# EAGLE schematic Evaluation_Board_v1.0 (EAGLE 9.6.2)
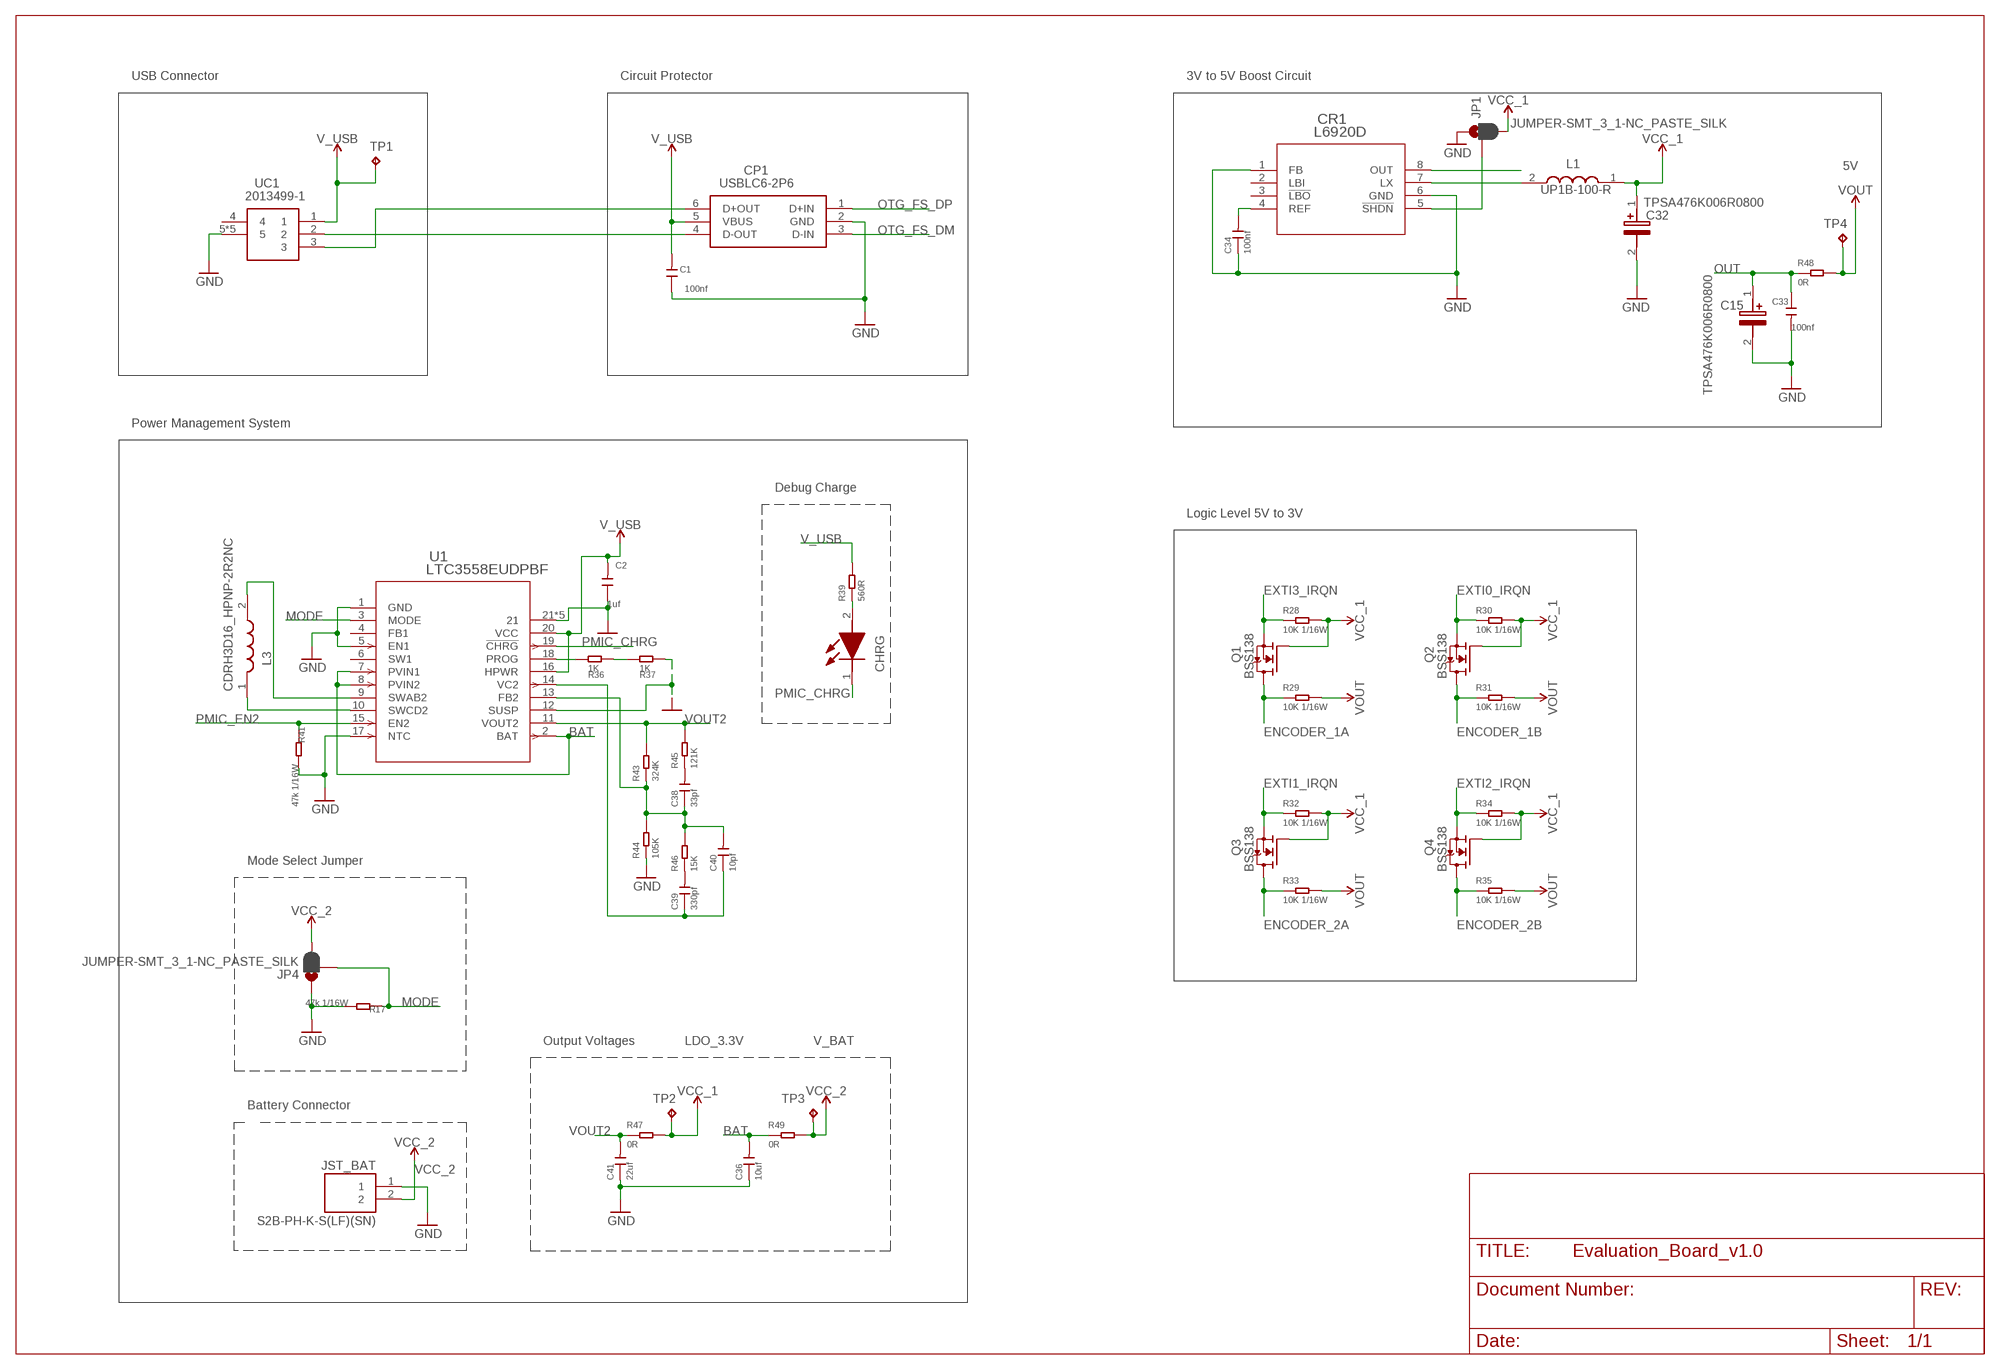
[diagram p0: schematic, sheet 1, part 1 of 3]
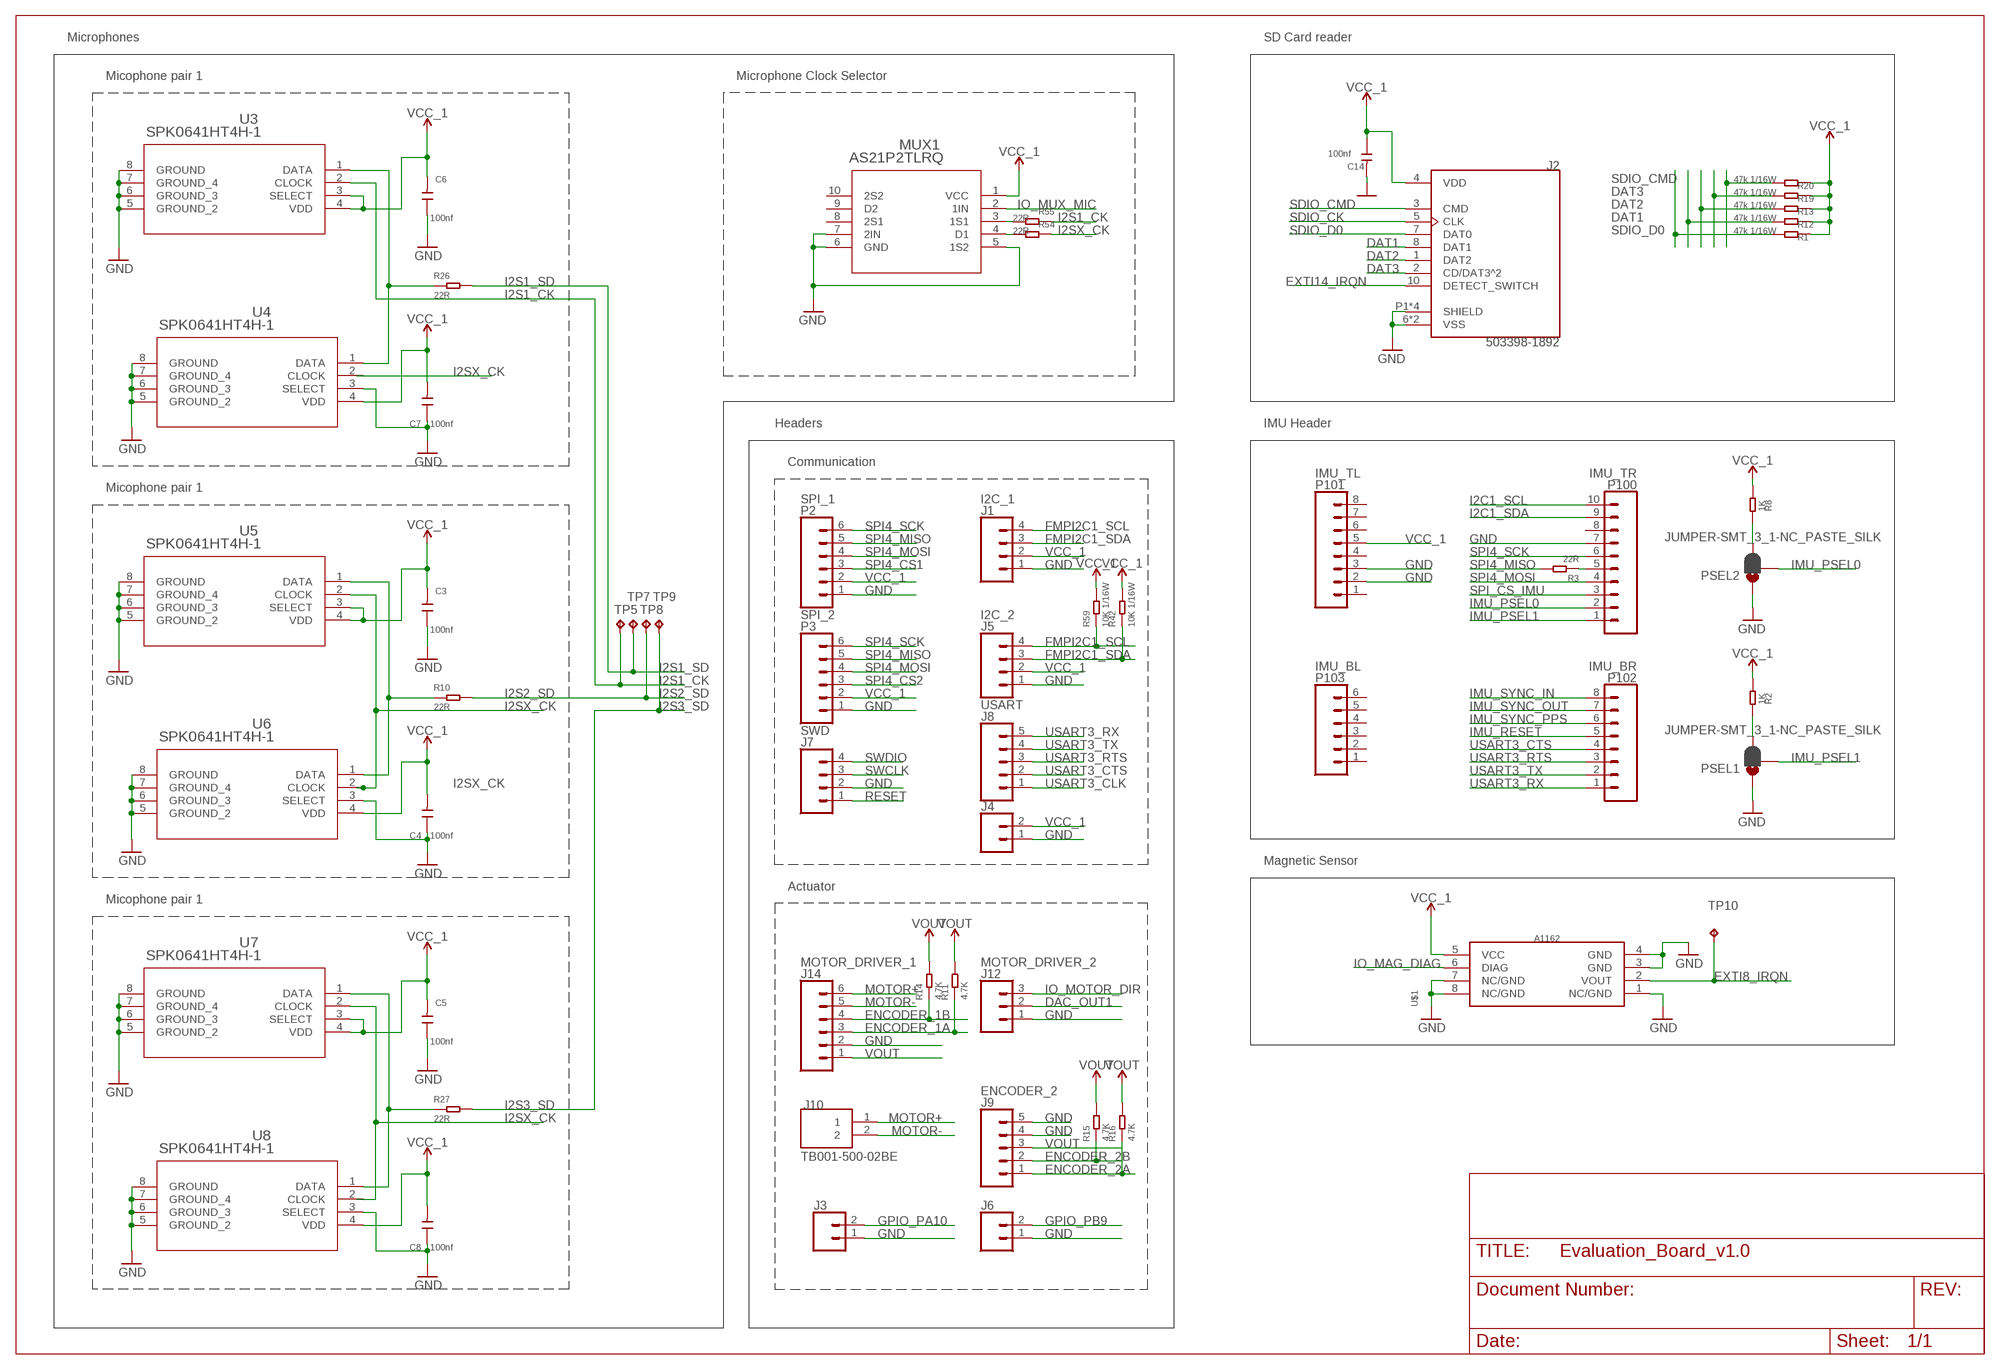
[diagram p1: schematic, sheet 1, part 2 of 3]
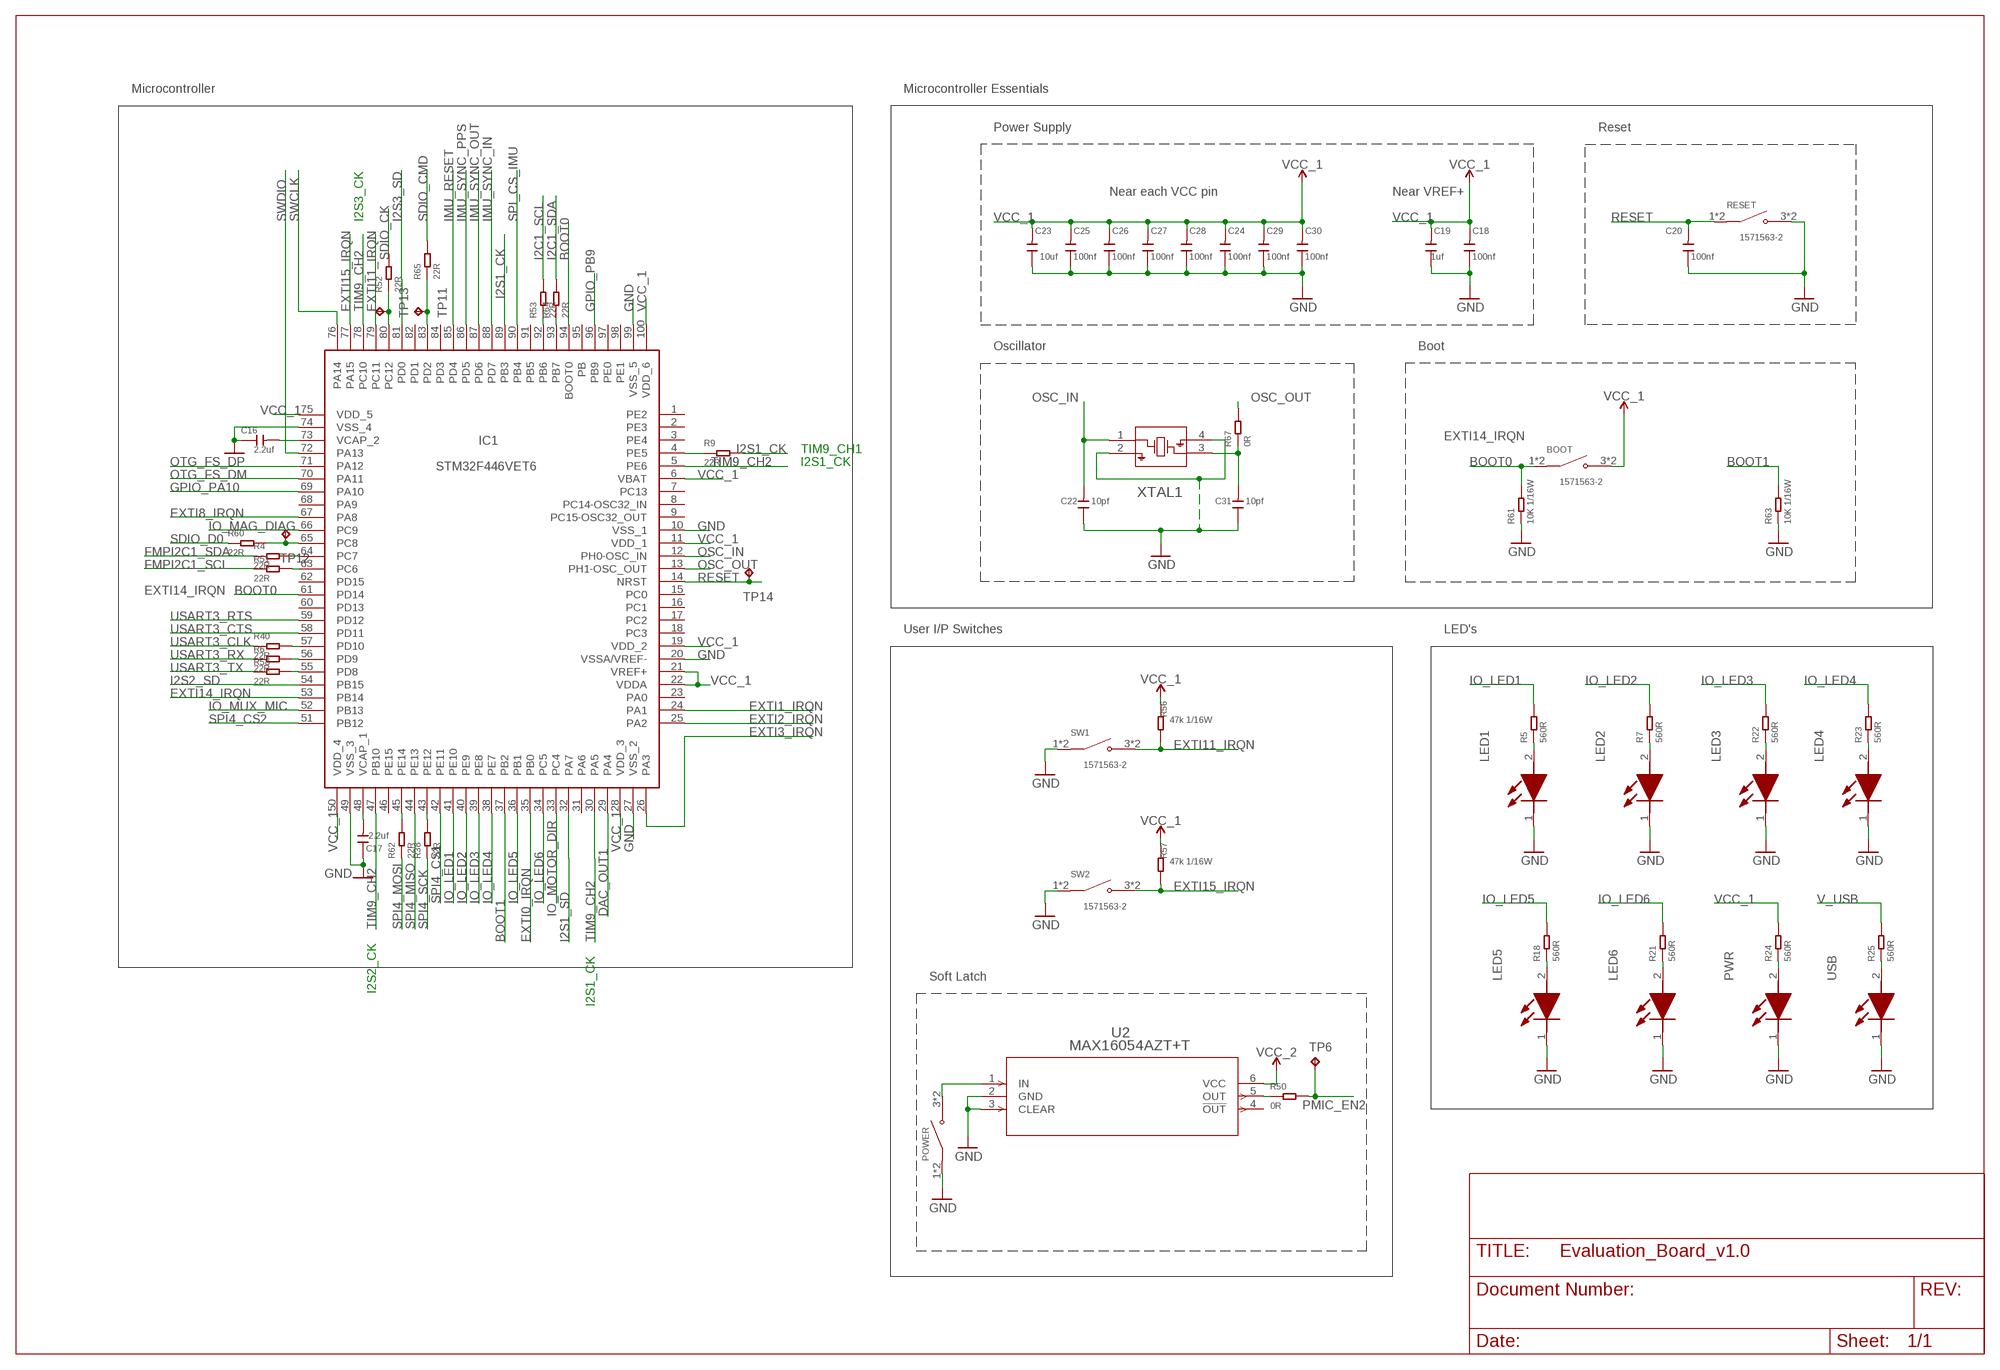
[diagram p2: schematic, sheet 1, part 3 of 3]

## Parts
BOOT  1571563-2  [SW_1571563-2]
C1  100nf  CERAMIC-100NF-25V-10%-X7R(0402)  [C0402]
C2  1uf  CERAMIC-1UF-10V-10%-X5R(0402)  [C0402]
C3  100nf  CERAMIC-100NF-25V-10%-X7R(0402)  [C0402]
C4  100nf  CERAMIC-100NF-25V-10%-X7R(0402)  [C0402]
C5  100nf  CERAMIC-100NF-25V-10%-X7R(0402)  [C0402]
C6  100nf  CERAMIC-100NF-25V-10%-X7R(0402)  [C0402]
C7  100nf  CERAMIC-100NF-25V-10%-X7R(0402)  [C0402]
C8  100nf  CERAMIC-100NF-25V-10%-X7R(0402)  [C0402]
C14  100nf  CERAMIC-100NF-25V-10%-X7R(0402)  [C0402]
C15  TPSA476K006R0800  [CAPPM3216X180N]
C16  2.2uf  CERAMIC-2.2UF-10V-10%-X7R(0603)  [C0603]
C17  2.2uf  CERAMIC-2.2UF-10V-10%-X7R(0603)  [C0603]
C18  100nf  CERAMIC-100NF-25V-10%-X7R(0402)  [C0402]
C19  1uf  CERAMIC-1UF-10V-10%-X5R(0402)  [C0402]
C20  100nf  CERAMIC-100NF-25V-10%-X7R(0402)  [C0402]
C22  10pf  CERAMIC-10PF-50V-5%-NPO(0402)  [C0402]
C23  10uf  CERAMIC-10UF-10V-10%-X5R(0603)  [C0603]
C24  100nf  CERAMIC-100NF-25V-10%-X7R(0402)  [C0402]
C25  100nf  CERAMIC-100NF-25V-10%-X7R(0402)  [C0402]
C26  100nf  CERAMIC-100NF-25V-10%-X7R(0402)  [C0402]
C27  100nf  CERAMIC-100NF-25V-10%-X7R(0402)  [C0402]
C28  100nf  CERAMIC-100NF-25V-10%-X7R(0402)  [C0402]
C29  100nf  CERAMIC-100NF-25V-10%-X7R(0402)  [C0402]
C30  100nf  CERAMIC-100NF-25V-10%-X7R(0402)  [C0402]
C31  10pf  CERAMIC-10PF-50V-5%-NPO(0402)  [C0402]
C32  TPSA476K006R0800  [CAPPM3216X180N]
C33  100nf  CERAMIC-100NF-25V-10%-X7R(0402)  [C0402]
C34  100nf  CERAMIC-100NF-25V-10%-X7R(0402)  [C0402]
C36  10uf  CERAMIC-10UF-10V-10%-X5R(0603)  [C0603]
C38  33pf  CERAMIC-33PF-50V-5%-NPO(0402)  [C0402]
C39  330pf  CERAMIC-33PF-50V-5%-NPO(0402)  [C0402]
C40  10pf  CERAMIC-10PF-50V-5%-NPO(0402)  [C0402]
C41  22uf  CERAMIC-22UF-6.3V-20%-X5R(0805)  [C0805]
CHRG  SML-P12MTT86R  [LEDM106X25N]
CP1  USBLC6-2P6  [USBLC62P6]
CR1  L6920D  [TSSOP8_STM]
IC1  STM32F446VET6  [QFP50P1600X1600X160-100N]
J1  I2C_1  CONN_04  [1X04]
J2  503398-1892  [MOLEX_503398-1892]
J3  CONN_02  [1X02]
J4  CONN_02  [1X02]
J5  I2C_2  CONN_04  [1X04]
J6  CONN_02  [1X02]
J7  SWD  CONN_04  [1X04]
J8  USART  CONN_05  [1X05]
J9  ENCODER_2  CONN_05  [1X05]
J10  TB001-500-02BE  [CUI_TB001-500-02BE]
J12  MOTOR_DRIVER_2  CONN_03  [1X03]
J14  MOTOR_DRIVER_1  CONN_06POLAR  [MOLEX-1X6]
JP1  JUMPER-SMT_3_1-NC_PASTE_SILK  [SMT-JUMPER_3_1-NC_PASTE_SILK]
JP4  JUMPER-SMT_3_1-NC_PASTE_SILK  [SMT-JUMPER_3_1-NC_PASTE_SILK]
JST_BAT  S2B-PH-K-S(LF)(SN)  [JST_S2B-PH-K-S(LF)(SN)]
L1  UP1B-100-R  [INDM9060X500N]
L3  CDRH3D16_HPNP-2R2NC  [CDRH3D16HPNP2R2NC]
LED1  SML-P12MTT86R  [LEDM106X25N]
LED2  SML-P12MTT86R  [LEDM106X25N]
LED3  SML-P12MTT86R  [LEDM106X25N]
LED4  SML-P12MTT86R  [LEDM106X25N]
LED5  SML-P12MTT86R  [LEDM106X25N]
LED6  SML-P12MTT86R  [LEDM106X25N]
MUX1  AS21P2TLRQ  [QFN10_1P8X1P4X0P5_STM]
P2  SPI_1  CONN_06SILK_FEMALE_PTH  [1X06]
P3  SPI_2  CONN_06SILK_FEMALE_PTH  [1X06]
P100  IMU_TR  CONN_10"  [1X10]
P101  IMU_TL  CONN_08"  [1X08]
P102  IMU_BR  CONN_08"  [1X08]
P103  IMU_BL  CONN_06SILK_FEMALE_PTH  [1X06]
POWER  1571563-2  [SW_1571563-2]
PSEL1  JUMPER-SMT_3_1-NC_PASTE_SILK  [SMT-JUMPER_3_1-NC_PASTE_SILK]
PSEL2  JUMPER-SMT_3_1-NC_PASTE_SILK  [SMT-JUMPER_3_1-NC_PASTE_SILK]
PWR  SML-P12MTT86R  [LEDM106X25N]
Q1  BSS138  [SOT95P240X111-3N]
Q2  BSS138  [SOT95P240X111-3N]
Q3  BSS138  [SOT95P240X111-3N]
Q4  BSS138  [SOT95P240X111-3N]
R1  47k 1/16W  SMD-RES-47R-1%-1/16W(0402)  [R0402]
R2  1K  SMD-RES-1K-1%-1/10W(0603)  [R0603]
R3  22R  SMD-RES-22R-1%-1/16W(0402)  [R0402]
R4  22R  SMD-RES-22R-1%-1/16W(0402)  [R0402]
R5  560R  SMD-RES-560R-5%-1/10W(0603)  [R0603]
R6  22R  SMD-RES-22R-1%-1/16W(0402)  [R0402]
R7  560R  SMD-RES-560R-5%-1/10W(0603)  [R0603]
R8  1K  SMD-RES-1K-1%-1/10W(0603)  [R0603]
R9  22R  SMD-RES-22R-1%-1/16W(0402)  [R0402]
R10  22R  SMD-RES-22R-1%-1/16W(0402)  [R0402]
R11  4.7K  SMD-RES-3.3K-1%-1/16W(0402)  [R0402]
R12  47k 1/16W  SMD-RES-47R-1%-1/16W(0402)  [R0402]
R13  47k 1/16W  SMD-RES-47R-1%-1/16W(0402)  [R0402]
R14  4.7K  SMD-RES-3.3K-1%-1/16W(0402)  [R0402]
R15  4.7K  SMD-RES-3.3K-1%-1/16W(0402)  [R0402]
R16  4.7K  SMD-RES-3.3K-1%-1/16W(0402)  [R0402]
R17  47k 1/16W  SMD-RES-47R-1%-1/16W(0402)  [R0402]
R18  560R  SMD-RES-560R-5%-1/10W(0603)  [R0603]
R19  47k 1/16W  SMD-RES-47R-1%-1/16W(0402)  [R0402]
R20  47k 1/16W  SMD-RES-47R-1%-1/16W(0402)  [R0402]
R21  560R  SMD-RES-560R-5%-1/10W(0603)  [R0603]
R22  560R  SMD-RES-560R-5%-1/10W(0603)  [R0603]
R23  560R  SMD-RES-560R-5%-1/10W(0603)  [R0603]
R24  560R  SMD-RES-560R-5%-1/10W(0603)  [R0603]
R25  560R  SMD-RES-560R-5%-1/10W(0603)  [R0603]
R26  22R  SMD-RES-22R-1%-1/16W(0402)  [R0402]
R27  22R  SMD-RES-22R-1%-1/16W(0402)  [R0402]
R28  10K 1/16W  SMD-RES-10K-1%-1/16W(0402)  [R0402]
R29  10K 1/16W  SMD-RES-10K-1%-1/16W(0402)  [R0402]
R30  10K 1/16W  SMD-RES-10K-1%-1/16W(0402)  [R0402]
R31  10K 1/16W  SMD-RES-10K-1%-1/16W(0402)  [R0402]
R32  10K 1/16W  SMD-RES-10K-1%-1/16W(0402)  [R0402]
R33  10K 1/16W  SMD-RES-10K-1%-1/16W(0402)  [R0402]
R34  10K 1/16W  SMD-RES-10K-1%-1/16W(0402)  [R0402]
R35  10K 1/16W  SMD-RES-10K-1%-1/16W(0402)  [R0402]
R36  1K  SMD-RES-1K-1%-1/10W(0603)  [R0603]
R37  1K  SMD-RES-1K-1%-1/10W(0603)  [R0603]
R38  22R  SMD-RES-22R-1%-1/16W(0402)  [R0402]
R39  560R  SMD-RES-560R-5%-1/10W(0603)  [R0603]
R40  22R  SMD-RES-22R-1%-1/16W(0402)  [R0402]
R41  47k 1/16W  SMD-RES-47R-1%-1/16W(0402)  [R0402]
R42  10K 1/16W  SMD-RES-10K-1%-1/16W(0402)  [R0402]
R43  324K  SMD-RES-470K-1%-1/10W(0603)  [R0603]
R44  105K  SMD-RES-470K-1%-1/10W(0603)  [R0603]
R45  121K  SMD-RES-470K-1%-1/10W(0603)  [R0603]
R46  15K  SMD-RES-470K-1%-1/10W(0603)  [R0603]
R47  0R  SMD-RES-0R-1%-1/8W(0805)  [R0805]
R48  0R  SMD-RES-0R-1%-1/8W(0805)  [R0805]
R49  0R  SMD-RES-0R-1%-1/8W(0805)  [R0805]
R50  0R  SMD-RES-0R-1%-1/8W(0805)  [R0805]
R51  22R  SMD-RES-22R-1%-1/16W(0402)  [R0402]
R52  22R  SMD-RES-22R-1%-1/16W(0402)  [R0402]
R53  22R  SMD-RES-22R-1%-1/16W(0402)  [R0402]
R54  22R  SMD-RES-22R-1%-1/16W(0402)  [R0402]
R55  22R  SMD-RES-22R-1%-1/16W(0402)  [R0402]
R56  47k 1/16W  SMD-RES-47R-1%-1/16W(0402)  [R0402]
R57  47k 1/16W  SMD-RES-47R-1%-1/16W(0402)  [R0402]
R58  22R  SMD-RES-22R-1%-1/16W(0402)  [R0402]
R59  10K 1/16W  SMD-RES-10K-1%-1/16W(0402)  [R0402]
R60  22R  SMD-RES-22R-1%-1/16W(0402)  [R0402]
R61  10K 1/16W  SMD-RES-10K-1%-1/16W(0402)  [R0402]
R62  22R  SMD-RES-22R-1%-1/16W(0402)  [R0402]
R63  10K 1/16W  SMD-RES-10K-1%-1/16W(0402)  [R0402]
R64  22R  SMD-RES-22R-1%-1/16W(0402)  [R0402]
R65  22R  SMD-RES-22R-1%-1/16W(0402)  [R0402]
R67  0R  SMD-RES-0R-5%-1/16W(0402)  [R0402]
RESET  1571563-2  [SW_1571563-2]
SW1  1571563-2  [SW_1571563-2]
SW2  1571563-2  [SW_1571563-2]
TP1  TPB1,27  [B1,27]
TP2  TPB1,27  [B1,27]
TP3  TPB1,27  [B1,27]
TP4  TPB1,27  [B1,27]
TP5  TPB1,27  [B1,27]
TP6  TPB1,27  [B1,27]
TP7  TPB1,27  [B1,27]
TP8  TPB1,27  [B1,27]
TP9  TPB1,27  [B1,27]
TP10  TPB1,27  [B1,27]
TP11  TPB1,27  [B1,27]
TP12  TPB1,27  [B1,27]
TP13  TPB1,27  [B1,27]
TP14  TPB1,27  [B1,27]
U1  LTC3558EUDPBF  [QFN-20_UD_LIT]
U2  MAX16054AZT+T  [21-0114C_MXM]
U3  SPK0641HT4H-1  [SPK0641HT4H-1_KNO]
U4  SPK0641HT4H-1  [SPK0641HT4H-1_KNO]
U5  SPK0641HT4H-1  [SPK0641HT4H-1_KNO]
U6  SPK0641HT4H-1  [SPK0641HT4H-1_KNO]
U7  SPK0641HT4H-1  [SPK0641HT4H-1_KNO]
U8  SPK0641HT4H-1  [SPK0641HT4H-1_KNO]
U$1  A1162  [A1162-8]
UC1  2013499-1  [2013499-1]
USB  SML-P12MTT86R  [LEDM106X25N]
XTAL1  NX2520SA-16MHZ  NX2520SA-16MHZ-STD-CSW-4  [NX2520SA_NDK]

## Nets
BAT [Power]: C36.2 R49.1 U1.2(BAT) U1.7(PVIN1) U1.8(PVIN2)
BOOT0: BOOT.1(COM) BOOT.2(COM) IC1.61(PD14) IC1.94(BOOT0) R61.2
BOOT1: IC1.37(PB2) R63.2
DAC_OUT1: IC1.29(PA4) J12.2
DAT1: J2.8(DAT1) R12.1
DAT2: J2.1(DAT2) R13.1
DAT3: J2.2(CD/DAT3^2) R19.1
ENCODER_1A: J14.3 Q1.3(D) R11.1 R29.1
ENCODER_1B: J14.4 Q2.3(D) R14.1 R31.1
ENCODER_2A: J9.1 Q3.3(D) R16.1 R33.1
ENCODER_2B: J9.2 Q4.3(D) R15.1 R35.1
EXTI0_IRQN: IC1.35(PB0) Q2.2(S) R30.1
EXTI1_IRQN: IC1.24(PA1) Q3.2(S) R32.1
EXTI2_IRQN: IC1.25(PA2) Q4.2(S) R34.1
EXTI3_IRQN: IC1.26(PA3) Q1.2(S) R28.1
EXTI8_IRQN: IC1.67(PA8) TP10.TP U$1.2(VOUT)
EXTI11_IRQN: IC1.79(PC11) R56.1 SW1.3(NO) SW1.4(NO)
EXTI14_IRQN: IC1.53(PB14) J2.10(DETECT_SWITCH)
EXTI15_IRQN: IC1.77(PA15) R57.1 SW2.3(NO) SW2.4(NO)
FMPI2C1_SCL [Impedance Match]: J1.4 J5.4 R51.1 R59.1
FMPI2C1_SDA [Impedance Match]: J1.3 J5.3 R4.1 R42.1
GND [Power]: C1.1 C2.1 C3.1 C4.1 C5.1 C6.1 C7.1 C8.1 C14.2 C15.2(-) C16.1 C17.1 C18.1 C19.1 C20.1 C22.1 C23.1 C24.1 C25.1 C26.1 C27.1 C28.1 C29.1 C30.1 C31.1 C32.2(-) C33.2 C34.1 C36.1 C41.1 CP1.2(GND) CR1.1(FB) CR1.6(GND) IC1.10(VSS_1) IC1.20(VSSA/VREF-) IC1.27(VSS_2) IC1.49(VSS_3) IC1.74(VSS_4) IC1.99(VSS_5) J1.1 J2.6(VSS) J2.9(VSS) J2.P1(SHIELD) J2.P2(SHIELD) J2.P3(SHIELD) J2.P4(SHIELD) J3.1 J4.1 J5.1 J6.1 J7.2 J9.4 J9.5 J12.1 J14.2 JP1.1 JP4.1 JST_BAT.1 LED1.1(K) LED2.1(K) LED3.1(K) LED4.1(K) LED5.1(K) LED6.1(K) MUX1.5(1S2) MUX1.6(GND) MUX1.7(2IN) P2.1 P3.1 P100.7 P101.2 P101.3 POWER.1(COM) POWER.2(COM) PSEL1.1 PSEL2.1 PWR.1(K) R17.1 R37.2 R41.1 R44.1 R61.1 R63.1 RESET.3(NO) RESET.4(NO) SW1.1(COM) SW1.2(COM) SW2.1(COM) SW2.2(COM) U1.1(GND) U1.5(EN1) U1.12(SUSP) U1.17(NTC) U1.21 U1.P$1 U1.P$2 U1.P$3 U1.P$4 U2.2(GND) U2.3(CLEAR) U3.5(GROUND_2) U3.6(GROUND_3) U3.7(GROUND_4) U3.8(GROUND) U4.3(SELECT) U4.5(GROUND_2) U4.6(GROUND_3) U4.7(GROUND_4) U4.8(GROUND) U5.5(GROUND_2) U5.6(GROUND_3) U5.7(GROUND_4) U5.8(GROUND) U6.3(SELECT) U6.5(GROUND_2) U6.6(GROUND_3) U6.7(GROUND_4) U6.8(GROUND) U7.5(GROUND_2) U7.6(GROUND_3) U7.7(GROUND_4) U7.8(GROUND) U8.3(SELECT) U8.5(GROUND_2) U8.6(GROUND_3) U8.7(GROUND_4) U8.8(GROUND) U$1.1(NC/GND) U$1.3(GND) U$1.4(GND) U$1.7(NC/GND) U$1.8(NC/GND) UC1.5 UC1.6 UC1.7 UC1.8 UC1.9 USB.1(K) XTAL1.2 XTAL1.4
GPIO_PA10: IC1.69(PA10) J3.2
GPIO_PB9: IC1.96(PB9) J6.2
I2C1_SCL [Impedance Match]: P100.10 R53.2
I2C1_SDA [Impedance Match]: P100.9 R64.2
I2S1_CK [Impedance Match]: IC1.4(PE5) IC1.89(PB3) R9.1 R9.2 R55.2 TP5.TP U3.2(CLOCK)
I2S1_SD [Impedance Match]: IC1.32(PA7) R26.2 TP7.TP
I2S2_SD [Impedance Match]: IC1.54(PB15) R10.2 TP8.TP
I2S3_SD [Impedance Match]: IC1.81(PD0) R27.2 TP9.TP
I2SX_CK [Impedance Match]: R54.2 U4.2(CLOCK) U5.2(CLOCK) U6.2(CLOCK) U7.2(CLOCK) U8.2(CLOCK)
IMU_PSEL0: P100.2 PSEL2.2
IMU_PSEL1: P100.1 PSEL1.2
IMU_RESET: IC1.85(PD4) P102.5
IMU_SYNC_IN: IC1.88(PD7) P102.8
IMU_SYNC_OUT: IC1.87(PD6) P102.7
IMU_SYNC_PPS: IC1.86(PD5) P102.6
IO_LED1: IC1.41(PE10) R5.2
IO_LED2: IC1.40(PE9) R7.2
IO_LED3: IC1.39(PE8) R22.2
IO_LED4: IC1.38(PE7) R23.2
IO_LED5: IC1.36(PB1) R18.2
IO_LED6: IC1.34(PC5) R21.2
IO_MAG_DIAG: IC1.66(PC9) U$1.6(DIAG)
IO_MOTOR_DIR: IC1.33(PC4) J12.3
IO_MUX_MIC: IC1.52(PB13) MUX1.2(1IN)
MODE: JP4.2 R17.2 U1.3(MODE)
MOTOR+ [High Power]: J10.1 J14.6
MOTOR- [High Power]: J10.2 J14.5
N$1: C34.2 CR1.4(REF)
N$2 [Power]: CR1.7(LX) L1.2
N$3 [Differential Impedance]: CP1.4(D-OUT) UC1.2
N$4 [Differential Impedance]: CP1.6(D+OUT) UC1.3
N$5: R36.1 U1.18(PROG)
N$6: R36.2 R37.1
N$7: CHRG.2(A) R39.1
N$8: CR1.5(!SHDN) JP1.2
N$9: C38.2 R45.1
N$10: C17.2 IC1.48(VCAP_1)
N$11: R50.1 U2.5(OUT)
N$12: C38.1 C40.2 R43.1 R44.2 R46.2 U1.13(FB2)
N$13: C39.2 R46.1
N$14: C16.2 IC1.73(VCAP_2)
N$15: POWER.3(NO) POWER.4(NO) U2.1(IN)
N$16: PSEL1.3 R2.1
N$17: MUX1.4(D1) R54.1
N$18: L3.1 U1.10(SWCD2)
N$19 [Impedance Match]: C31.2 R67.1 XTAL1.3
N$20: PSEL2.3 R8.1
N$21: C39.1 C40.1 U1.14(VC2)
N$22: L3.2 U1.9(SWAB2)
N$23: LED1.2(A) R5.1
N$24: MUX1.3(1S1) R55.1
N$25: LED2.2(A) R7.1
N$26 [Impedance Match]: IC1.63(PC6) R51.2
N$27: LED5.2(A) R18.1
N$28: IC1.57(PD10) R40.2
N$29: LED6.2(A) R21.1
N$30 [Impedance Match]: IC1.43(PE12) R38.2
N$31: LED3.2(A) R22.1
N$32 [Impedance Match]: R10.1 U5.1(DATA) U6.1(DATA)
N$33: LED4.2(A) R23.1
N$34 [Impedance Match]: IC1.80(PC12) R52.1 TP13.TP
N$35: PWR.2(A) R24.1
N$36: IC1.92(PB6) R53.1
N$37: R25.1 USB.2(A)
N$38 [Impedance Match]: IC1.64(PC7) R4.2
N$39 [Impedance Match]: IC1.56(PD9) R6.2
N$40 [Impedance Match]: IC1.55(PD8) R58.2
N$41 [Impedance Match]: P100.5 R3.1
N$42 [Impedance Match]: IC1.65(PC8) R60.2 TP12.TP
N$43 [Impedance Match]: R27.1 U7.1(DATA) U8.1(DATA)
N$44 [Impedance Match]: IC1.45(PE14) R62.2
N$46 [Impedance Match]: IC1.93(PB7) R64.1
N$47 [Impedance Match]: IC1.83(PD2) R65.1 TP11.TP
N$49 [Impedance Match]: R26.1 U3.1(DATA) U4.1(DATA)
OSC_IN [Impedance Match]: C22.2 IC1.12(PH0-OSC_IN) XTAL1.1
OSC_OUT [Impedance Match]: IC1.13(PH1-OSC_OUT) R67.2
OTG_FS_DM [Differential Impedance]: CP1.3(D-IN) IC1.70(PA11)
OTG_FS_DP [Differential Impedance]: CP1.1(D+IN) IC1.71(PA12)
OUT [Power]: C15.1(+) C33.1 CR1.8(OUT) R48.1
PMIC_CHRG: CHRG.1(K) U1.19(!CHRG)
PMIC_EN2: R41.2 R50.2 TP6.TP U1.15(EN2)
RESET [Impedance Match]: C20.2 IC1.14(NRST) J7.1 RESET.1(COM) RESET.2(COM) TP14.TP
SDIO_CK [Impedance Match]: J2.5(CLK) R52.2
SDIO_CMD [Impedance Match]: J2.3(CMD) R20.1 R65.2
SDIO_D0 [Impedance Match]: J2.7(DAT0) R1.1 R60.1
SPI4_CS1: IC1.42(PE11) P2.3
SPI4_CS2: IC1.51(PB12) P3.3
SPI4_MISO [Impedance Match]: IC1.44(PE13) P2.5 P3.5 R3.2
SPI4_MOSI [Impedance Match]: P2.4 P3.4 P100.4 R62.1
SPI4_SCK [Impedance Match]: P2.6 P3.6 P100.6 R38.1
SPI_CS_IMU: IC1.90(PB4) P100.3
SWCLK [Impedance Match]: IC1.76(PA14) J7.3
SWDIO [Impedance Match]: IC1.72(PA13) J7.4
TIM9_CH2 [Impedance Match]: IC1.5(PE6) IC1.30(PA5) IC1.47(PB10) IC1.78(PC10)
USART3_CLK [Impedance Match]: J8.1 R40.1
USART3_CTS [Impedance Match]: IC1.58(PD11) J8.2 P102.4
USART3_RTS [Impedance Match]: IC1.59(PD12) J8.3 P102.3
USART3_RX [Impedance Match]: J8.5 P102.1 R6.1
USART3_TX [Impedance Match]: J8.4 P102.2 R58.1
V_USB [Power]: C1.2 C2.2 CP1.5(VBUS) R25.2 R39.2 TP1.TP U1.16(HPWR) U1.20(VCC) UC1.1
VCC_1 [Power]: BOOT.3(NO) BOOT.4(NO) C3.2 C4.2 C5.2 C6.2 C7.2 C8.2 C14.1 C18.2 C19.2 C23.2 C24.2 C25.2 C26.2 C27.2 C28.2 C29.2 C30.2 C32.1(+) IC1.6(VBAT) IC1.11(VDD_1) IC1.19(VDD_2) IC1.21(VREF+) IC1.22(VDDA) IC1.28(VDD_3) IC1.50(VDD_4) IC1.75(VDD_5) IC1.100(VDD_6) J1.2 J2.4(VDD) J4.2 J5.2 JP1.3 L1.1 MUX1.1(VCC) P2.2 P3.2 P101.5 Q1.1(G) Q2.1(G) Q3.1(G) Q4.1(G) R1.2 R2.2 R8.2 R12.2 R13.2 R19.2 R20.2 R24.2 R28.2 R30.2 R32.2 R34.2 R42.2 R47.2 R56.2 R57.2 R59.2 TP2.TP U3.3(SELECT) U3.4(VDD) U4.4(VDD) U5.3(SELECT) U5.4(VDD) U6.4(VDD) U7.3(SELECT) U7.4(VDD) U8.4(VDD) U$1.5(VCC)
VCC_2 [Power]: JP4.3 JST_BAT.2 R49.2 TP3.TP U2.6(VCC)
VOUT [Power]: J9.3 J14.1 R11.2 R14.2 R15.2 R16.2 R29.2 R31.2 R33.2 R35.2 R48.2 TP4.TP
VOUT2 [Power]: C41.2 R43.2 R45.2 R47.1 U1.11(VOUT2)
Unconnected: CR1.2(LBI) CR1.3(!LBO) IC1.1(PE2) IC1.2(PE3) IC1.3(PE4) IC1.7(PC13) IC1.8(PC14-OSC32_IN) IC1.9(PC15-OSC32_OUT) IC1.15(PC0) IC1.16(PC1) IC1.17(PC2) IC1.18(PC3) IC1.23(PA0) IC1.31(PA6) IC1.46(PE15) IC1.60(PD13) IC1.62(PD15) IC1.68(PA9) IC1.82(PD1) IC1.84(PD3) IC1.91(PB5) IC1.95(PB) IC1.97(PE0) IC1.98(PE1) MUX1.8(2S1) MUX1.9(D2) MUX1.10(2S2) P100.8 P101.1 P101.4 P101.6 P101.7 P101.8 P103.1 P103.2 P103.3 P103.4 P103.5 P103.6 U1.4(FB1) U1.6(SW1) U2.4(!OUT) UC1.4

## Notes on the sheet
- USB Connector | Circuit Protector | 3V to 5V Boost Circuit
- Microcontroller | Microcontroller Essentials
- Power Supply | Reset
- 5V
- Near each VCC pin | Near VREF+
- I2S3_CK
- Oscillator | Boot
- Power Management System
- EXTI14_IRQN
- TIM9_CH1
- I2S1_CK
- Debug Charge
- Logic Level 5V to 3V
- EXTI14_IRQN
- User I/P Switches | LED's
- Mode Select Jumper
- Soft Latch
- I2S2_CK
- I2S1_CK
- Output Voltages | LDO_3.3V | V_BAT
- Battery Connector
- Microphones | SD Card reader
- Micophone pair 1 | Microphone Clock Selector
- Headers | IMU Header
- Communication
- Micophone pair 1
- Magnetic Sensor
- Actuator
- Micophone pair 1

## Library data of the parts
BOOT POWER RESET SW1 SW2 = 1571563-2:1571563-2; COMMENT: 1571563-2; DESCRIPTION: Alcoswitch â€¢ Tactile Switches â€¢ Actuator Style: Round â€¢ Contact Configuration: SPST â€¢ Contact Rating: 50mA â€¢ Operating Function: Off [On] â€¢ Termination Type: Printed Circuit; DIGI-KEY_PART_NUMBER: 450-2057-1-ND; EU_ROHS_COMPLIANCE: Compliant; MF: TE Connectivity; MP: 1571563-2; PACKAGE: SMD-6 Omron Electronics; PURCHASE-URL: https://pricing.snapeda.com/search/part/1571563-2/?ref=eda
C1 C3-C8 C14 C18 C20 C24-C30 C33 C34 = OPL_Capacitor:CERAMIC-100NF-25V-10%-X7R(0402): 302010024; MPN: CC0402KRX7R8BB104
C2 C19 = OPL_Capacitor:CERAMIC-1UF-10V-10%-X5R(0402): 302010040; MPN: CC0402KRX5R6BB105
C15 C32 = TPSA476K006R0800:TPSA476K006R0800: Tantalum Capacitors - Solid SMD 47UF 6V 10% Source: Datasheet; DESCRIPTION: Tantalum Capacitors - Solid SMD 47UF 6V 10%; HEIGHT: 1.8mm; MANUFACTURER_NAME: AVX; MANUFACTURER_PART_NUMBER: TPSA476K006R0800; MOUSER_PART_NUMBER: 581-TPSA476K006R0800; MOUSER_PRICE-STOCK: https://www.mouser.com/Search/Refine.aspx?Keyword=581-TPSA476K006R0800
C16 C17 = OPL_Capacitor:CERAMIC-2.2UF-10V-10%-X7R(0603): 302010054; MPN: CC0603KRX7R6BB225
C22 C31 C40 = OPL_Capacitor:CERAMIC-10PF-50V-5%-NPO(0402): 302010001; MPN: CC0402JRNPO9BN100
C23 C36 = OPL_Capacitor:CERAMIC-10UF-10V-10%-X5R(0603): 302010103; MPN: CC0603KRX5R6BB106
C38 = OPL_Capacitor:CERAMIC-33PF-50V-5%-NPO(0402): 302010000; MPN: CC0402JRNPO9BN330
C39 = OPL_Capacitor:CERAMIC-33PF-50V-5%-NPO(0402): 302010000; MPN: CC0402JRNPO9BN330; VALUE: 33pf
C41 = OPL_Capacitor:CERAMIC-22UF-6.3V-20%-X5R(0805): 302010171; MPN: CC0805MKX5R5BB226
CHRG LED1-LED6 PWR USB = SML-P12MTT86R:SML-P12MTT86R: ROHM - SML-P12MTT86R - LED, YELLOW GREEN, 25MCD, 572NM, 0402 Source: Datasheet; DESCRIPTION: ROHM - SML-P12MTT86R - LED, YELLOW GREEN, 25MCD, 572NM, 0402; HEIGHT: 0.25mm; MANUFACTURER_NAME: ROHM Semiconductor; MANUFACTURER_PART_NUMBER: SML-P12MTT86R; MOUSER_PART_NUMBER: 755-SML-P12MTT86R; MOUSER_PRICE-STOCK: https://www.mouser.co.uk/ProductDetail/ROHM-Semiconductor/SML-P12MTT86R/?qs=Ei%2Fnxee9QYiD9LDKTr18UQ%3D%3D
CP1 = USBLC6-2P6:USBLC6-2P6: ESD Suppressors / TVS Diodes High Speed Interface Protection Low Cap Source: Datasheet; DESCRIPTION: ESD Suppressors / TVS Diodes High Speed Interface Protection Low Cap; HEIGHT: 0.6mm; MANUFACTURER_NAME: STMicroelectronics; MANUFACTURER_PART_NUMBER: USBLC6-2P6; MOUSER_PART_NUMBER: 511-USBLC6-2P6; MOUSER_PRICE-STOCK: https://www.mouser.co.uk/ProductDetail/STMicroelectronics/USBLC6-2P6?qs=6ARB0lp6jlViGcbUSvj1Mw%3D%3D
CR1 = L6920D:L6920D; BUILT_BY: EMA_UL_Team; MANUFACTURER_PART_NUMBER: L6920D; SOURCELIBRARY: Updates_to_database_2020-11-10; VENDOR: STMicroelectronics
IC1 = STM32F446VET6:STM32F446VET6: STMICROELECTRONICS - STM32F446VET6 - MCU, 32BIT, CORTEX-M4, 180MHZ, LQFP-100 Source: Datasheet; DESCRIPTION: STMICROELECTRONICS - STM32F446VET6 - MCU, 32BIT, CORTEX-M4, 180MHZ, LQFP-100; HEIGHT: 1.6mm; MANUFACTURER_NAME: STMicroelectronics; MANUFACTURER_PART_NUMBER: STM32F446VET6; MOUSER_PART_NUMBER: 511-STM32F446VET6; MOUSER_PRICE-STOCK: https://www.mouser.co.uk/ProductDetail/STMicroelectronics/STM32F446VET6?qs=Ok1pvOkw6%2Fq9jAtbG%252BoMSQ%3D%3D
J1 J5 J7 = SparkFun-Connectors:CONN_04: Multi connection point. Often used as Generic Header-pin footprint for 0.1 inch spaced/style header connections On any of the 0.1 inch spaced packages, you can populate with these: Break Away Headers - Straight (PRT-00116) Break Away Male Headers - Right Angle (PRT-00553) Female Headers (PRT-00115) Break Away Headers - Machine Pin (PRT-00117) Break Away Female Headers - Swiss Machine Pin (PRT-00743) For SCREWTERMINALS and SPRING TERMINALS visit here: Screw Terimnals on SparkFun.com (5mm/3.5mm/2.54mm spacing) This device is also useful as a general connection point to wire up your design to another part of your project. Our various solder wires solder well into these plated through hole pads. Hook-Up Wire - Assortment (Stranded, 22 AWG) (PRT-11375) Hook-Up Wire - Assortment (Solid Core, 22 AWG) (PRT-11367) View the entire wire category on our website here Special notes: Molex polarized connector foot print use with SKU : PRT-08231 with associated crimp pins and housings. 1MM SMD Version SKU: PRT-10208; PROD_ID: CONN-09696
J2 = 503398-1892:503398-1892: 1.10mm Pitch microSD Memory Card Connector, Normal Mount Surface Mount, Push-Push Type, 1.28mm Height; DESCRIPTION: 9 (8 + 1) Position Card Connector Secure Digital - microSD™ Surface Mount, Right Angle Gold; DIGI-KEY_PART_NUMBER: WM11190CT-ND; MF: Molex; MP: 5033981892; PACKAGE: None; PURCHASE-URL: https://pricing.snapeda.com/search/part/5033981892/?ref=eda
J3 J4 J6 = SparkFun-Connectors:CONN_02: Multi connection point. Often used as Generic Header-pin footprint for 0.1 inch spaced/style header connections On any of the 0.1 inch spaced packages, you can populate with these: Break Away Headers - Straight (PRT-00116) Break Away Male Headers - Right Angle (PRT-00553) Female Headers (PRT-00115) Break Away Headers - Machine Pin (PRT-00117) Break Away Female Headers - Swiss Machine Pin (PRT-00743) For SCREWTERMINALS and SPRING TERMINALS visit here: Screw Terimnals on SparkFun.com (5mm/3.5mm/2.54mm spacing) This device is also useful as a general connection point to wire up your design to another part of your project. Our various solder wires solder well into these plated through hole pads. Hook-Up Wire - Assortment (Stranded, 22 AWG) (PRT-11375) Hook-Up Wire - Assortment (Solid Core, 22 AWG) (PRT-11367) View the entire wire category on our website here Special notes: Molex polarized connector foot print use with: PRT-08233 with associated crimp pins and housings. 2.54_SCREWTERM for use with PRT-10571. 3.5mm Screw Terminal footprints for PRT-08084 5mm Screw Terminal footprints for use with PRT-08432
J8 J9 = SparkFun-Connectors:CONN_05: Multi connection point. Often used as Generic Header-pin footprint for 0.1 inch spaced/style header connections On any of the 0.1 inch spaced packages, you can populate with these: Break Away Headers - Straight (PRT-00116) Break Away Male Headers - Right Angle (PRT-00553) Female Headers (PRT-00115) Break Away Headers - Machine Pin (PRT-00117) Break Away Female Headers - Swiss Machine Pin (PRT-00743) For SCREWTERMINALS and SPRING TERMINALS visit here: Screw Terimnals on SparkFun.com (5mm/3.5mm/2.54mm spacing) This device is also useful as a general connection point to wire up your design to another part of your project. Our various solder wires solder well into these plated through hole pads. Hook-Up Wire - Assortment (Stranded, 22 AWG) (PRT-11375) Hook-Up Wire - Assortment (Solid Core, 22 AWG) (PRT-11367) View the entire wire category on our website here Special notes: Molex polarized connector foot print use with SKU : PRT-08231 with associated crimp pins and housings. 1MM SMD Version SKU: PRT-10208
J10 = TB001-500-02BE:TB001-500-02BE; CUI_PURCHASE_URL: https://www.cuidevices.com/product/interconnect/connectors/terminal-blocks/tb001-500-series?utm_source=snapeda.com&utm_medium=referral&utm_campaign=snapedaBOM; DESCRIPTION: 2~24 Poles, Screw Type, Horizontal, 5.0 Pitch, 22~12 (AWG), Terminal Block Connector; DIGI-KEY_PART_NUMBER: 102-6134-ND; MF: CUI Devices; MP: TB001-500-02BE; PACKAGE: None; PURCHASE-URL: https://pricing.snapeda.com/search/part/TB001-500-02BE/?ref=eda
J12 = SparkFun-Connectors:CONN_03: Multi connection point. Often used as Generic Header-pin footprint for 0.1 inch spaced/style header connections On any of the 0.1 inch spaced packages, you can populate with these: Break Away Headers - Straight (PRT-00116) Break Away Male Headers - Right Angle (PRT-00553) Female Headers (PRT-00115) Break Away Headers - Machine Pin (PRT-00117) Break Away Female Headers - Swiss Machine Pin (PRT-00743) Stackable Header - 3 Pin (Female, 0.1") (PRT-13875) For SCREWTERMINALS and SPRING TERMINALS visit here: Screw Terimnals on SparkFun.com (5mm/3.5mm/2.54mm spacing) This device is also useful as a general connection point to wire up your design to another part of your project. Our various solder wires solder well into these plated through hole pads. Hook-Up Wire - Assortment (Stranded, 22 AWG) (PRT-11375) Hook-Up Wire - Assortment (Solid Core, 22 AWG) (PRT-11367) View the entire wire category on our website here Special notes: Molex polarized connector foot print use with SKU : PRT-08232 with associated crimp pins and housings.
J14 = SparkFun-Connectors:CONN_06: Multi connection point. Often used as Generic Header-pin footprint for 0.1 inch spaced/style header connections On any of the 0.1 inch spaced packages, you can populate with these: Break Away Headers - Straight (PRT-00116) Break Away Male Headers - Right Angle (PRT-00553) Female Headers (PRT-00115) Break Away Headers - Machine Pin (PRT-00117) Break Away Female Headers - Swiss Machine Pin (PRT-00743) Arduino Stackable Header - 6 Pin (PRT-09280) For SCREWTERMINALS and SPRING TERMINALS visit here: Screw Terimnals on SparkFun.com (5mm/3.5mm/2.54mm spacing) This device is also useful as a general connection point to wire up your design to another part of your project. Our various solder wires solder well into these plated through hole pads. Hook-Up Wire - Assortment (Stranded, 22 AWG) (PRT-11375) Hook-Up Wire - Assortment (Solid Core, 22 AWG) (PRT-11367) View the entire wire category on our website here
JP1 JP4 PSEL1 PSEL2 = SparkFun-Jumpers:JUMPER-SMT_3_1-NC_PASTE: Normally closed solder jumper (1 of 2 connections) This jumper has an aperture in the stencil to allow solder paste to bridge one of the two connections. One connection is normally closed (NC), while the other is normally open (NO). Wick off the solder to open the connection. Reapply solder to reclose the connection. Apply solder to the other side instead to change the current path.
JST_BAT = S2B-PH-K-S_LF__SN_:S2B-PH-K-S(LF)(SN): PH Series 2 Position 2.0 mm Through Hole Side Entry Shrouded Header; DESCRIPTION: Connector Header Through Hole, Right Angle 2 position; DIGI-KEY_PART_NUMBER: 455-1719-ND; MF: JST Sales America Inc.; MP: S2B-PH-K-S(LF)(SN); PACKAGE: Custom Package JST Sales America Inc.; PURCHASE-URL: https://pricing.snapeda.com/search/part/S2B-PH-K-S(LF)(SN)/?ref=eda
L1 = UP1B-100-R:UP1B-100-R: POWER INDUCTOR 10H +/-20% 1.5A Source: Datasheet; DESCRIPTION: POWER INDUCTOR 10H +/-20% 1.5A; HEIGHT: mm; MANUFACTURER_NAME: COILTRONICS; MANUFACTURER_PART_NUMBER: UP1B-100-R
L3 = CDRH3D16_HPNP-2R2NC:CDRH3D16_HPNP-2R2NC: Fixed Inductors 2.2uH 2.30A 47ohms Source: Datasheet; DESCRIPTION: Fixed Inductors 2.2uH 2.30A 47ohms; HEIGHT: 1.8mm; MANUFACTURER_NAME: Sumida; MANUFACTURER_PART_NUMBER: CDRH3D16/HPNP-2R2NC; MOUSER_PART_NUMBER: 851-CDRH3D16HPNP2R2
MUX1 = AS21P2TLR:AS21P2TLRQ; BUILT_BY: EMA_Anthony; COPYRIGHT: Copyright (C) 2018 Accelerated Designs. All rights reserved; DATASHEET: https://www.st.com/content/ccc/resource/technical/document/datasheet/43/25/a8/f9/e9/81/42/1d/DM00109582.pdf/files/DM00109582.pdf/jcr:content/translations/en.DM00109582.pdf; MANUFACTURER_PART_NUMBER: AS21P2TLRQ; SOURCELIBRARY: Add_to_database_2021-01-22; VENDOR: STMicroelectronics
P2 P3 P103 = SparkFun-Connectors:CONN_06: Multi connection point. Often used as Generic Header-pin footprint for 0.1 inch spaced/style header connections On any of the 0.1 inch spaced packages, you can populate with these: Break Away Headers - Straight (PRT-00116) Break Away Male Headers - Right Angle (PRT-00553) Female Headers (PRT-00115) Break Away Headers - Machine Pin (PRT-00117) Break Away Female Headers - Swiss Machine Pin (PRT-00743) Arduino Stackable Header - 6 Pin (PRT-09280) For SCREWTERMINALS and SPRING TERMINALS visit here: Screw Terimnals on SparkFun.com (5mm/3.5mm/2.54mm spacing) This device is also useful as a general connection point to wire up your design to another part of your project. Our various solder wires solder well into these plated through hole pads. Hook-Up Wire - Assortment (Stranded, 22 AWG) (PRT-11375) Hook-Up Wire - Assortment (Solid Core, 22 AWG) (PRT-11367) View the entire wire category on our website here; PROD_ID: CONN-08437
P100 = SparkFun-Connectors:CONN_10: Multi connection point. Often used as Generic Header-pin footprint for 0.1 inch spaced/style header connections On any of the 0.1 inch spaced packages, you can populate with these: Break Away Headers - Straight (PRT-00116) Break Away Male Headers - Right Angle (PRT-00553) Female Headers (PRT-00115) Break Away Headers - Machine Pin (PRT-00117) Break Away Female Headers - Swiss Machine Pin (PRT-00743) Arduino Stackable Header - 10 Pin (PRT-11376) For SCREWTERMINALS and SPRING TERMINALS visit here: Screw Terimnals on SparkFun.com (5mm/3.5mm/2.54mm spacing) This device is also useful as a general connection point to wire up your design to another part of your project. Our various solder wires solder well into these plated through hole pads. Hook-Up Wire - Assortment (Stranded, 22 AWG) (PRT-11375) Hook-Up Wire - Assortment (Solid Core, 22 AWG) (PRT-11367) View the entire wire category on our website here Special notes: Molex polarized connector foot print use with SKU : PRT-08231 with associated crimp pins and housings. 1MM SMD Version SKU: PRT-10208 NOTES ON THE VARIANTS LOCK and LOCK_LONGPADS... This footprint was designed to help hold the alignment of a through-hole component (i.e. 6-pin header) while soldering it into place. You may notice that each hole has been shifted either up or down by 0.005 of an inch from it's more standard position (which is a perfectly straight line). This slight alteration caused the pins (the squares in the middle) to touch the edges of the holes. Because they are alternating, it causes a "brace" to hold the component in place. 0.005 has proven to be the perfect amount of "off-center" position when using our standard breakaway headers. Although looks a little odd when you look at the bare footprint, once you have a header in there, the alteration is very hard to notice. Also,if you push a header all the way into place, it is covered up entirely on the bottom side.; PROD_ID: CONN-11563
P101 P102 = SparkFun-Connectors:CONN_08: Multi connection point. Often used as Generic Header-pin footprint for 0.1 inch spaced/style header connections On any of the 0.1 inch spaced packages, you can populate with these: Break Away Headers - Straight (PRT-00116) Break Away Male Headers - Right Angle (PRT-00553) Female Headers (PRT-00115) Break Away Headers - Machine Pin (PRT-00117) Break Away Female Headers - Swiss Machine Pin (PRT-00743) Arduino Stackable Header - 8 Pin (PRT-09279) For SCREWTERMINALS and SPRING TERMINALS visit here: Screw Terimnals on SparkFun.com (5mm/3.5mm/2.54mm spacing) This device is also useful as a general connection point to wire up your design to another part of your project. Our various solder wires solder well into these plated through hole pads. Hook-Up Wire - Assortment (Stranded, 22 AWG) (PRT-11375) Hook-Up Wire - Assortment (Solid Core, 22 AWG) (PRT-11367) View the entire wire category on our website here Special notes: Molex polarized connector foot print use with SKU : PRT-08231 with associated crimp pins and housings. 1MM SMD Version SKU: PRT-10208 NOTES ON THE VARIANTS LOCK and LOCK_LONGPADS... This footprint was designed to help hold the alignment of a through-hole component (i.e. 6-pin header) while soldering it into place. You may notice that each hole has been shifted either up or down by 0.005 of an inch from it's more standard position (which is a perfectly straight line). This slight alteration caused the pins (the squares in the middle) to touch the edges of the holes. Because they are alternating, it causes a "brace" to hold the component in place. 0.005 has proven to be the perfect amount of "off-center" position when using our standard breakaway headers. Although looks a little odd when you look at the bare footprint, once you have a header in there, the alteration is very hard to notice. Also,if you push a header all the way into place, it is covered up entirely on the bottom side.; PROD_ID: CONN-08438
Q1-Q4 = BSS138:BSS138: N-Channel 50V 220mA (Ta) 360mW (Ta) Surface Mount SOT-23-3; DESCRIPTION: N-Channel 50V 200mA (Ta) 225mW (Ta) Surface Mount SOT-23-3 (TO-236); DIGI-KEY_PART_NUMBER: BSS138WCT-ND; MF: ON Semiconductor; MP: BSS138; PACKAGE: SOT-23 ON; PURCHASE-URL: https://pricing.snapeda.com/search/part/BSS138/?ref=eda
R1 R12 R13 R17 R19 R20 R41 R56 R57 = OPL_Resistor:SMD-RES-47R-1%-1/16W(0402): 301012001; MPN: RC0402JR-070RL; VALUE: 0R
R2 R8 R36 R37 = OPL_Resistor:SMD-RES-1K-1%-1/10W(0603): 301011969; MPN: RC0603FR-071KL
R3 R4 R6 R9 R10 R26 R27 R38 R40 R51-R55 R58 R60 R62 R64 R65 = OPL_Resistor:SMD-RES-22R-1%-1/16W(0402): 301010052; MPN: RC0402FR-0722RL
R5 R7 R18 R21-R25 R39 = OPL_Resistor:SMD-RES-560R-5%-1/10W(0603): 301012137; MPN: RC0603FR-071K5L; VALUE: 1.5K
R11 R14-R16 = OPL_Resistor:SMD-RES-3.3K-1%-1/16W(0402): 301011999; MPN: RC0402JR-070RL; VALUE: 0R
R28-R35 R42 R59 R61 R63 = OPL_Resistor:SMD-RES-10K-1%-1/16W(0402): 301010047; MPN: RC0402FR-0710KL
R43-R46 = OPL_Resistor:SMD-RES-470K-1%-1/10W(0603): 301012073; MPN: RC0603FR-071K5L; VALUE: 1.5K
R47-R50 = OPL_Resistor:SMD-RES-0R-1%-1/8W(0805): 301012149; MPN: RC0805JR-071KL; VALUE: 1K
R67 = OPL_Resistor:SMD-RES-0R-5%-1/16W(0402): 301012006; MPN: RC0402JR-070RL
TP1-TP14 = testpad:TP: Test pad
U1 = LTC3558:LTC3558EUDPBF; BUILT_BY: EMA_UL_Team; MANUFACTURER_PART_NUMBER: ltc3558eud#pbf; SOURCELIBRARY: LinearTech_2016_03_08; VENDOR: Linear Technology
U2 = MAX16054:MAX16054AZT+T; BUILT_BY: EMA_UL_Team; MANUFACTURER_PART_NUMBER: max16054azt+t; REVISION: 1; SOURCELIBRARY: Maxim_2009-12-17_2; VENDOR: Maxim Integrated Products
U3-U8 = SPK0641HT4H-1:SPK0641HT4H-1; BUILT_BY: EMA_Cory; COPYRIGHT: Copyright (C) 2018 Accelerated Designs. All rights reserved; DATASHEET: https://www.knowles.com/docs/default-source/model-downloads/spk0641ht4h-1-rev-a.pdf; MANUFACTURER_PART_NUMBER: SPK0641HT4H-1; SOURCELIBRARY: Knowles_2020-06-11; VENDOR: Knowles
U$1 = A1162_Magnetic_Sensor:A1162
UC1 = 2013499-1:2013499-1: AMP - TE CONNECTIVITY - 2013499-1 - MICRO USB CONN, 2.0 TYPE B, RCPT, SMT Source: Datasheet; DESCRIPTION: AMP - TE CONNECTIVITY - 2013499-1 - MICRO USB CONN, 2.0 TYPE B, RCPT, SMT; HEIGHT: mm; MANUFACTURER_NAME: TE Connectivity; MANUFACTURER_PART_NUMBER: 2013499-1; MOUSER_PART_NUMBER: 571-2013499-1; MOUSER_PRICE-STOCK: https://www.mouser.co.uk/ProductDetail/TE-Connectivity/2013499-1/?qs=TL6PIybY3BOLK37GbUYdng%3D%3D
XTAL1 = NX2520SA-16MHZ:NX2520SA-16MHZ-STD-CSW-4; BUILT_BY: EMA_Cory; COPYRIGHT: Copyright (C) 2018 Accelerated Designs. All rights reserved; DATASHEET: https://www.ndk.com/images/products/catalog/c_NX2520SA_e.pdf; MANUFACTURER_PART_NUMBER: NX2520SA-16MHZ-STD-CSW-4; SOURCELIBRARY: Add_to_database_2021-03-30; VENDOR: NDK America

## Net classes
1 Impedance Match: width 0.203 mm
2 Power: width 0.152 mm
3 High Power: width 0.762 mm
4 Differential Impedance: width 0.152 mm, clearance 0.152 mm